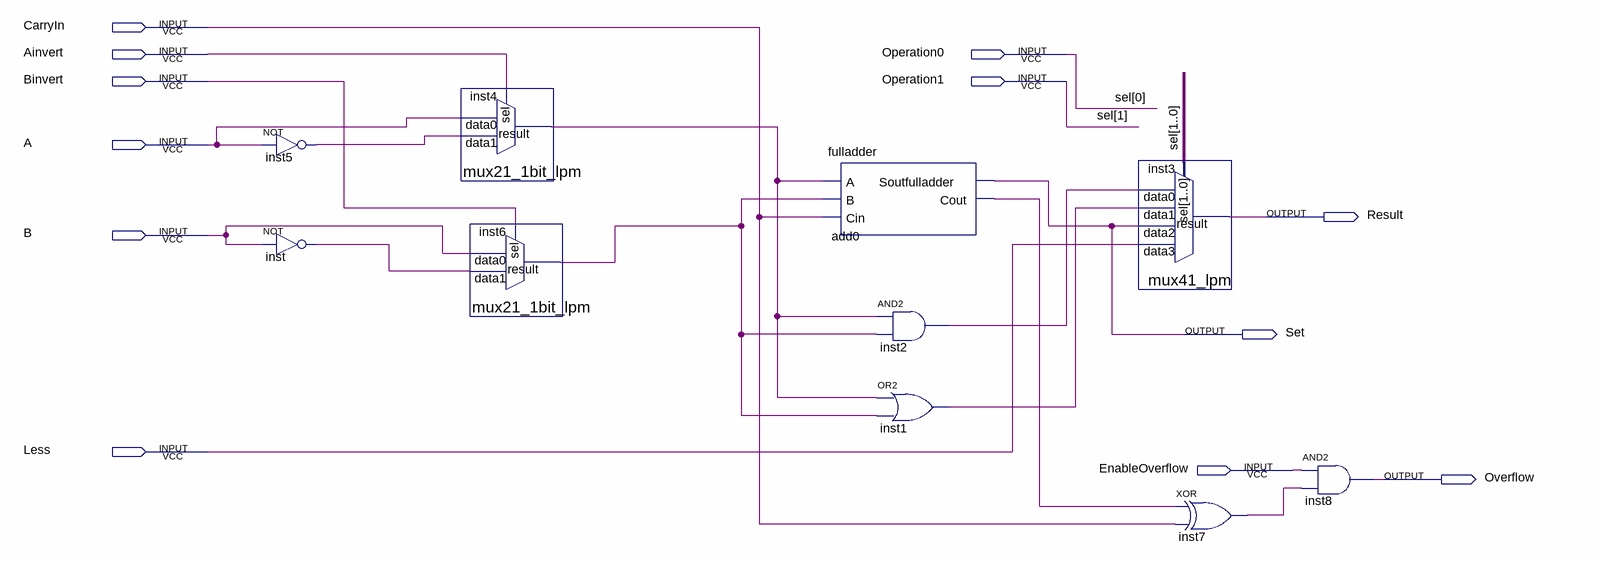
[diagram p0: schematic sheet]
// Quartus schematic 1bitALU5functionsOverflow.bdf as structural Verilog: 10 symbols, 12 pins
module \1bitALU5functionsOverflow  (
  input  CarryIn,
  input  Ainvert,
  input  Operation0,
  input  Binvert,
  input  Operation1,
  input  A,
  input  B,
  input  Less,
  input  EnableOverflow,
  output Result,
  output Set,
  output Overflow
);

  wire add0_cout, inst1_out, inst2_out, inst4_result, inst5_out, inst6_result, inst7_out, inst_out;

  not inst5 (inst5_out, A);
  not inst (inst_out, B);
  mux21_1bit_lpm inst4 (.data1(inst5_out), .data0(A), .sel(Ainvert), .result(inst4_result));
  mux21_1bit_lpm inst6 (.data1(inst_out), .data0(B), .sel(Binvert), .result(inst6_result));
  fulladder add0 (.A(inst4_result), .B(inst6_result), .Cin(CarryIn), .Soutfulladder(Set), .Cout(add0_cout));
  and inst2 (inst2_out, inst4_result, inst6_result);
  or inst1 (inst1_out, inst4_result, inst6_result);
  mux41_lpm inst3 (
    .data3(Less), .data2(Set), .data1(inst1_out), .data0(inst2_out), .sel({Operation1, Operation0}),
    .result(Result));
  xor inst7 (inst7_out, add0_cout, CarryIn);
  and inst8 (Overflow, EnableOverflow, inst7_out);

  // Other names for the same wires on the sheet: sel[1:0] = {Operation1, Operation0}
endmodule
